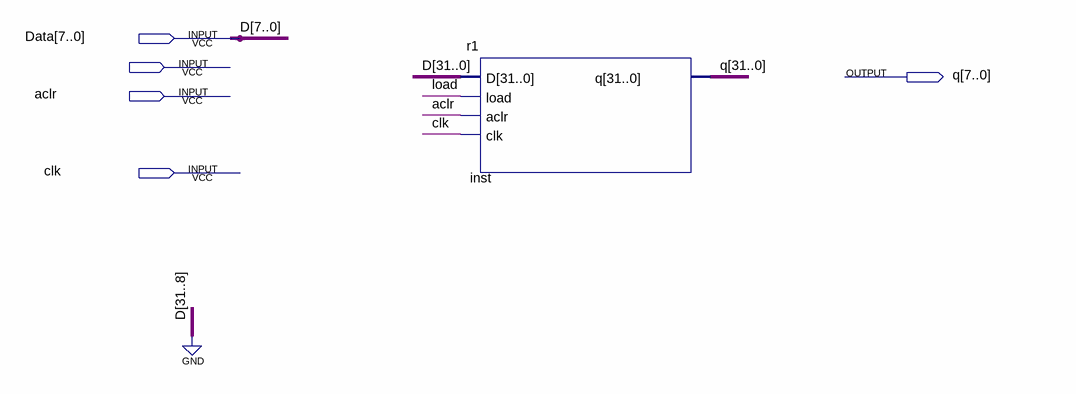
[diagram p0: schematic sheet]
// Quartus schematic r1_8bit.bdf as structural Verilog: 1 symbols, 5 pins
module r1_8bit (
  input  [7:0] Data,
  input  aclr,
  input  clk,
  output [31:0] q
);

  wire load;

  r1 inst (.D({{24{1'b0}}, Data}), .load(load), .aclr(aclr), .clk(clk), .q(q));

  // Other names for the same wires on the sheet: D[7:0] = Data
endmodule
